# Altium schematic sheet JD-Signal-SCH-V2.0.SchDoc
size A2; SheetNumber: 1; SheetTotal: 1; SPICEModelCacheNNRSJVYG: <root> / <DocumentId>NNRSJVYG</DocumentId> / <CacheFrame Number="0"> / <Model Name="npn" Kind="MDL"> / <Text>*Default NPN BJT / *NPN Trans Pinout: C,B,E / .MODEL NPN NPN()</Text> / </Model> / <Model Name="xtal" Kind="CKT"> / <Text>*Generic type:crystal pkg:HC33/51 / .SUBCKT XTAL 1 2 PARAMS: FREQ=1Meg RS=750 C=13pf Q=1000 / LX 1 3 {((Q*RS)/(6.2831852*FREQ))} IC=0.5M / CX 3 4 {(1/(Q*6.2831852*FREQ*RS))} / C0 1 2 {C} / RS 4 2 {RS} / .ENDS XTAL</Text> / </Model> / </CacheFrame> / </root>
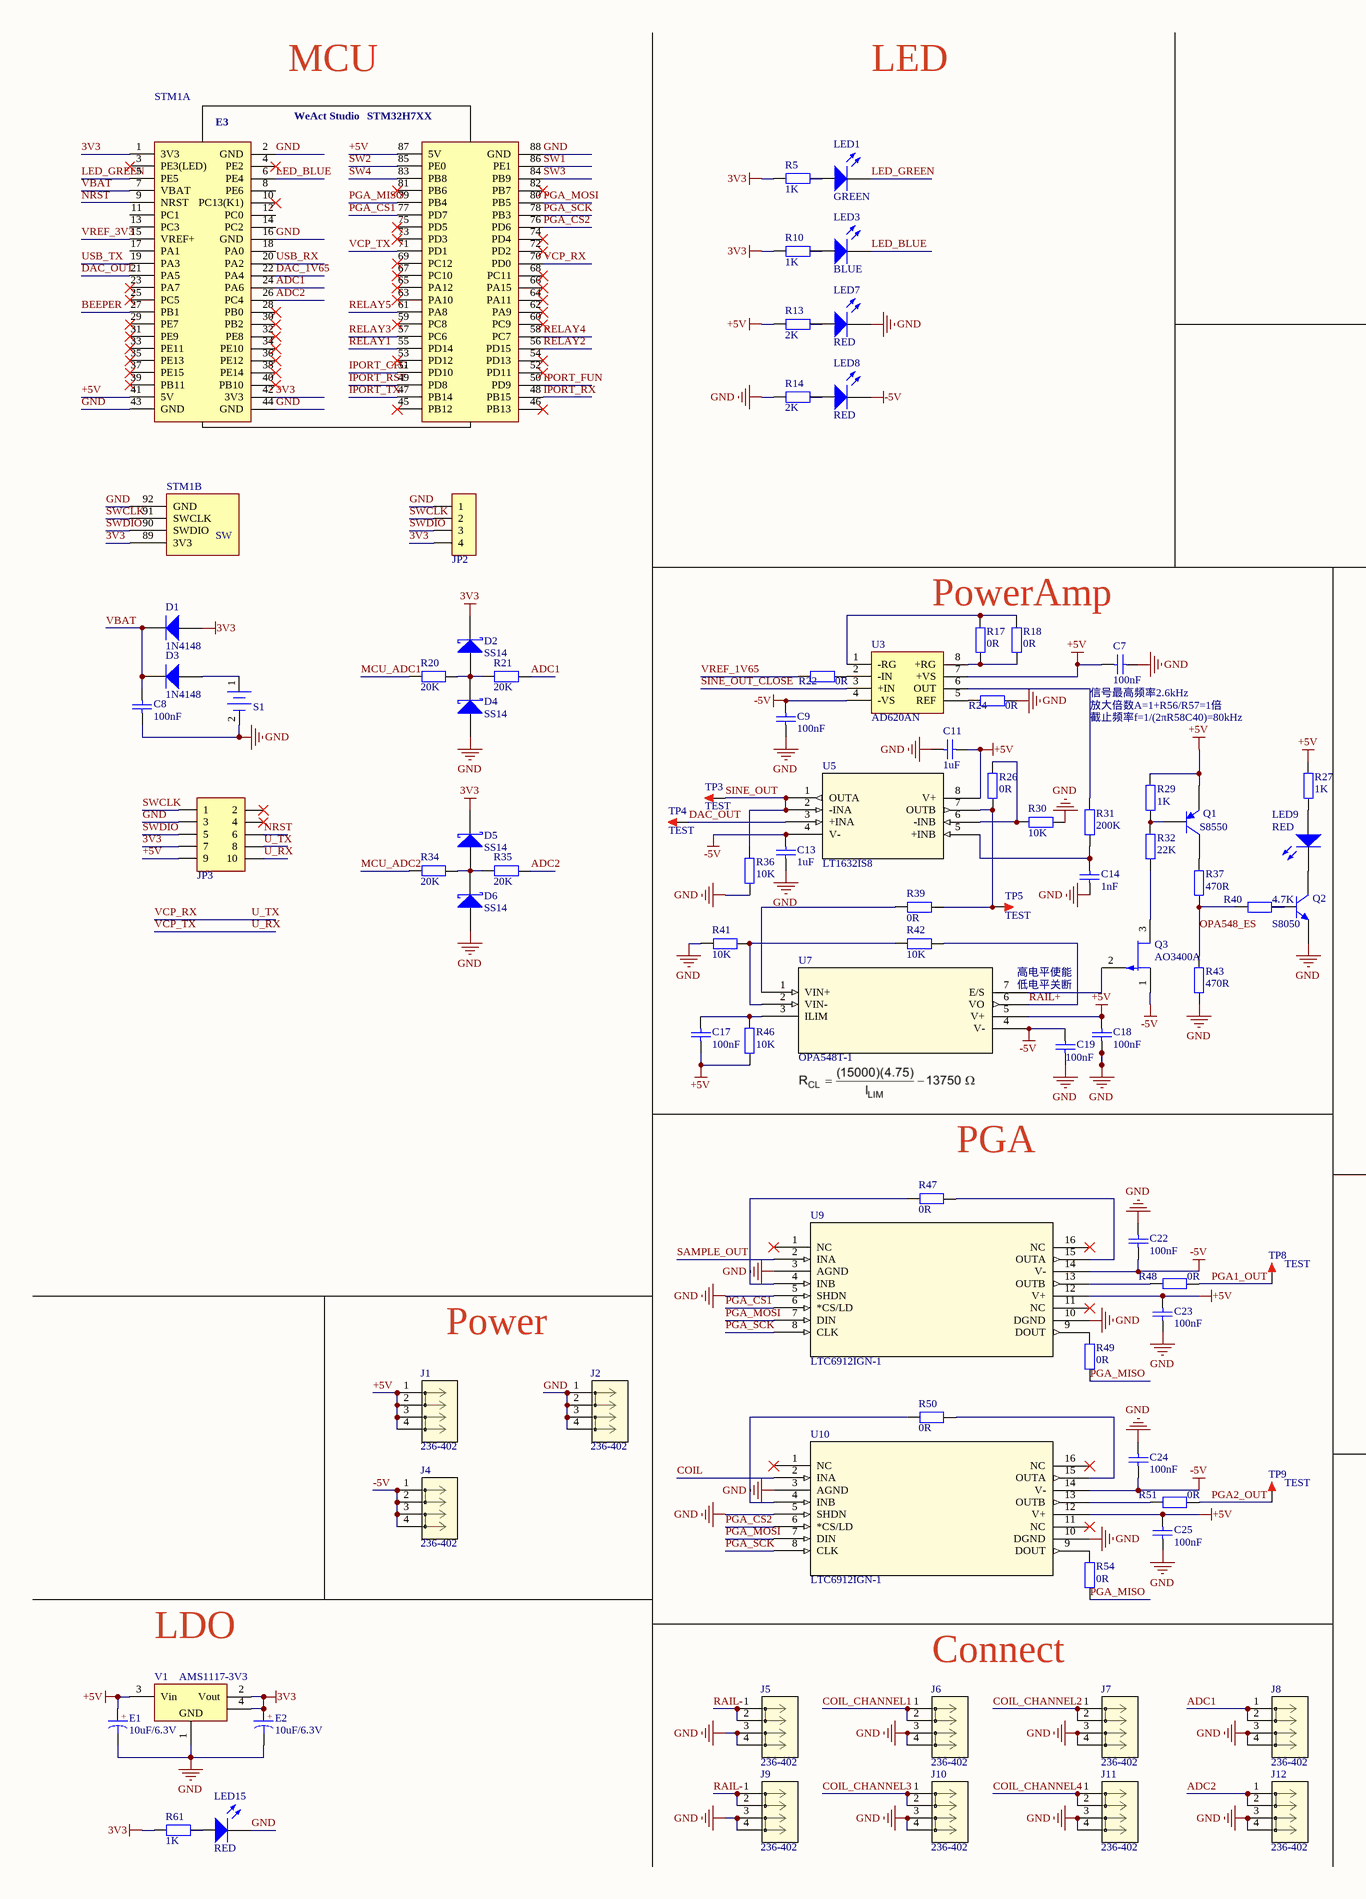
[diagram p0: JD-Signal-SCH-V2.0.SchDoc, left]
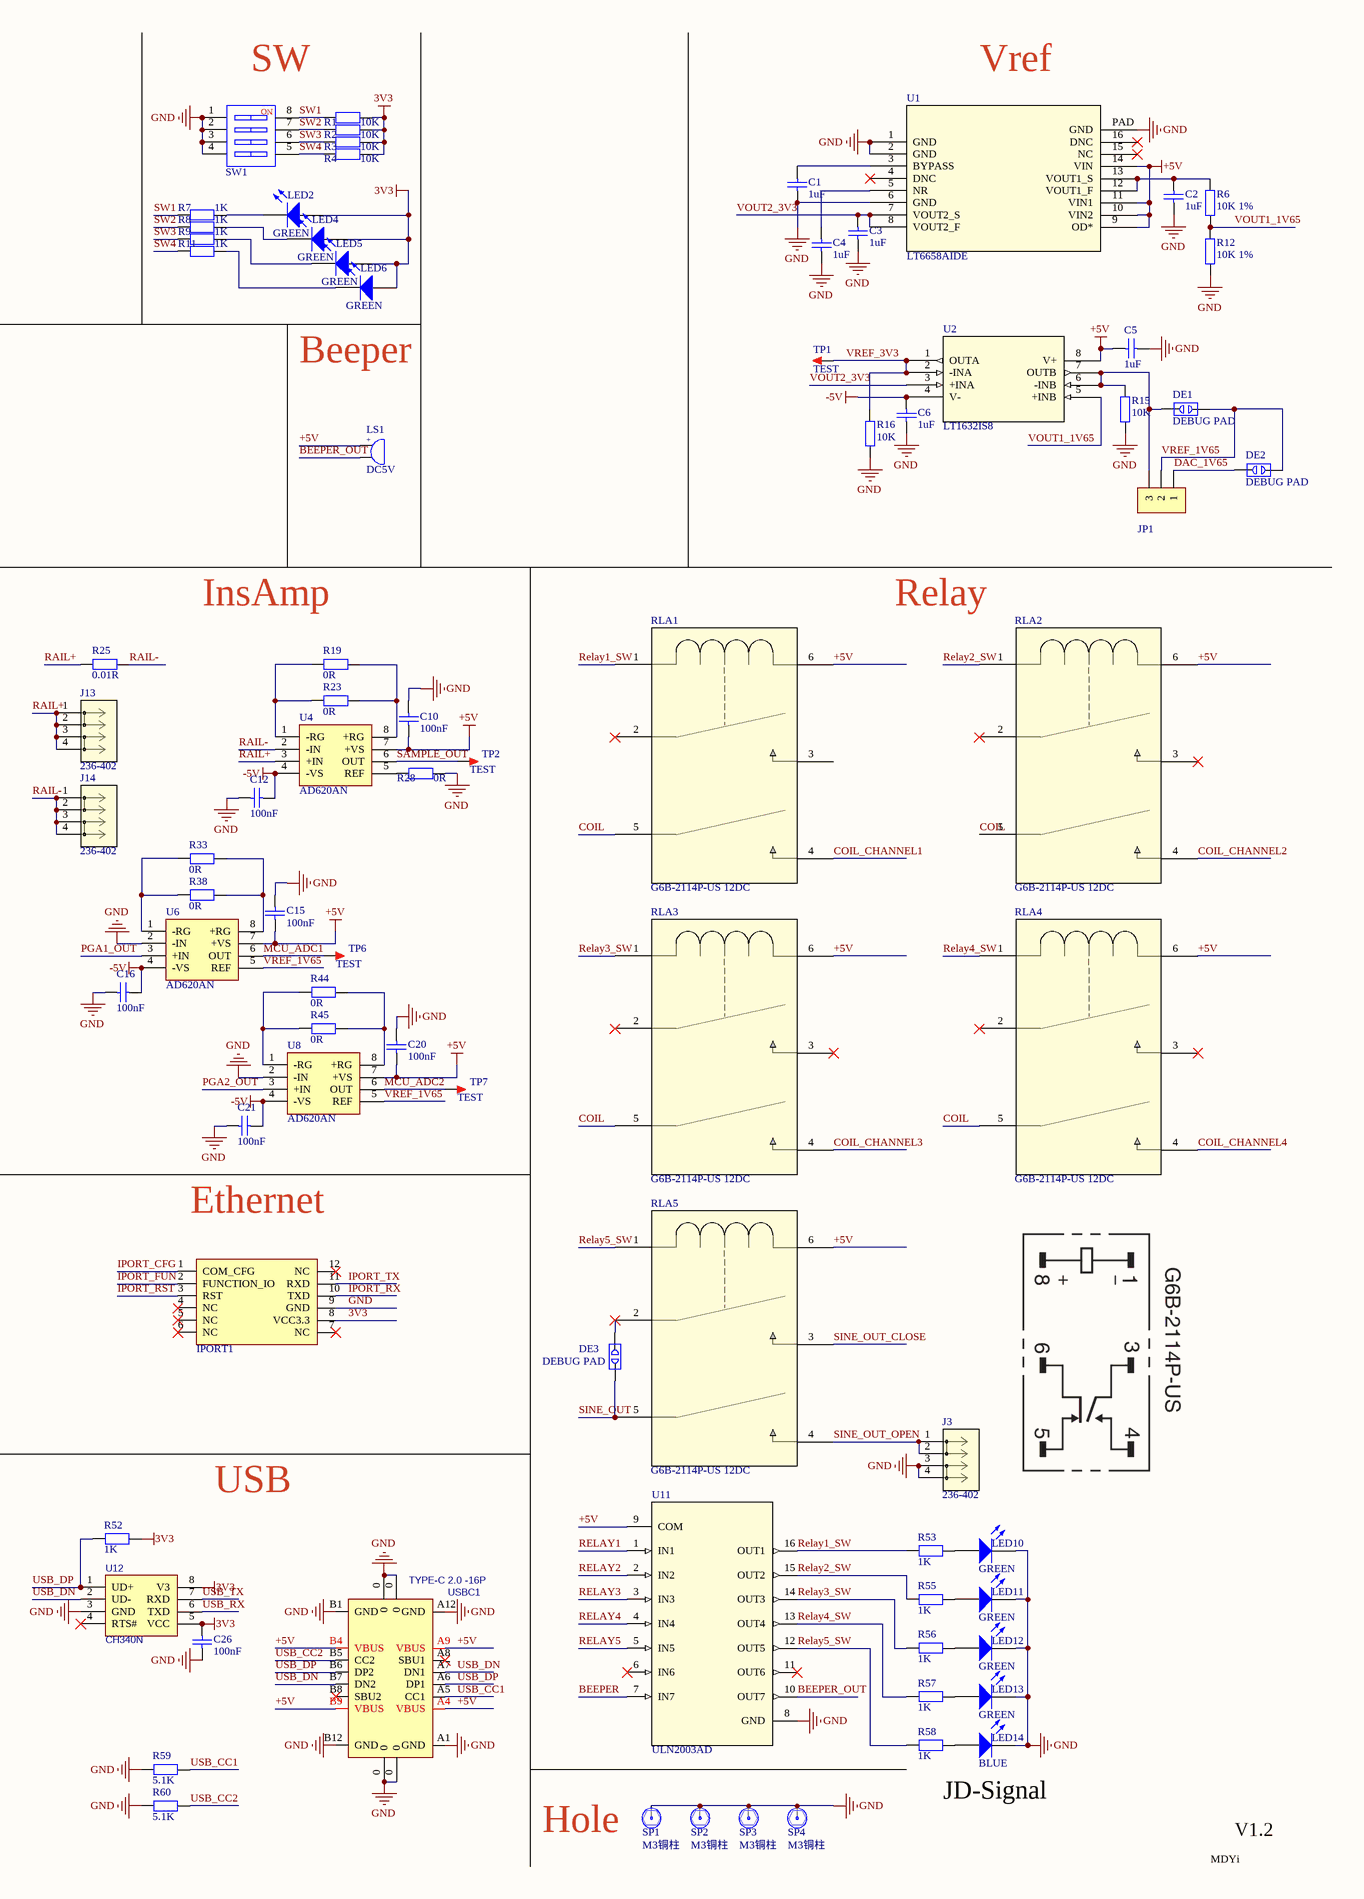
[diagram p1: JD-Signal-SCH-V2.0.SchDoc, right]

## Parts
C1  1uF  [C0603_M]
C2  1uF  [C0603_M]
C3  1uF  [C0603_M]
C4  1uF  [C0603_M]
C5  1uF  [C0603_M]
C6  1uF  [C0603_M]
C7  100nF  [C0603_M]
C8  100nF  [C0603_M]
C9  100nF  [C0603_M]
C10  100nF  [C0603_M]
C11  1uF  [C0603_M]
C12  100nF  [C0603_M]
C13  1uF  [C0603_M]
C14  1nF  [C0603_M]
C15  100nF  [C0603_M]
C16  100nF  [C0603_M]
C17  100nF  [C0603_M]
C18  100nF  [C0603_M]
C19  100nF  [C0603_M]
C20  100nF  [C0603_M]
C21  100nF  [C0603_M]
C22  100nF  [C0603_M]
C23  100nF  [C0603_M]
C24  100nF  [C0603_M]
C25  100nF  [C0603_M]
C26  100nF  [C0603_M]
D1  1N4148  [SOD-323]
D2  SS14  [SMA]
D3  1N4148  [SOD-323]
D4  SS14  [SMA]
D5  SS14  [SMA]
D6  SS14  [SMA]
DE1  DEBUG PAD  [DEBUG_B]
DE2  DEBUG PAD  [DEBUG_B]
DE3  DEBUG PAD  [DEBUG_B]
E1  10uF/6.3V  [C_3216]
E2  10uF/6.3V  [C_3216]
IPORT1  IPORT-3  [IPORT]  (value not drawn)
J1  236-402  [CONN_236-402_WAG]
J2  236-402  [CONN_236-402_WAG]
J3  236-402  [CONN_236-402_WAG]
J4  236-402  [CONN_236-402_WAG]
J5  236-402  [CONN_236-402_WAG]
J6  236-402  [CONN_236-402_WAG]
J7  236-402  [CONN_236-402_WAG]
J8  236-402  [CONN_236-402_WAG]
J9  236-402  [CONN_236-402_WAG]
J10  236-402  [CONN_236-402_WAG]
J11  236-402  [CONN_236-402_WAG]
J12  236-402  [CONN_236-402_WAG]
J13  236-402  [CONN_236-402_WAG]
J14  236-402  [CONN_236-402_WAG]
JP1  HDR-1X3  [HDR2.54-LI-3P]  (value not drawn)
JP2  HDR-1X4  [HDR2.54-LI-4P]  (value not drawn)
JP3  Header 5X2  [HDR2.54-LI-2x5P]  (value not drawn)
LED1  GREEN  [LED0603_R]
LED2  GREEN  [LED0603_R]
LED3  BLUE  [LED0603_R]
LED4  GREEN  [LED0603_R]
LED5  GREEN  [LED0603_R]
LED6  GREEN  [LED0603_R]
LED7  RED  [LED0603_R]
LED8  RED  [LED0603_R]
LED9  RED  [LED0603_R]
LED10  GREEN  [LED0603_R]
LED11  GREEN  [LED0603_R]
LED12  GREEN  [LED0603_R]
LED13  GREEN  [LED0603_R]
LED14  BLUE  [LED0603_R]
LED15  RED  [LED0603_R]
LS1  DC5V  [BEEP 5x9x5.5]
Q1  S8550  [SOT23]
Q2  S8050  [SOT23]
Q3  AO3400A  [SOT23]
R1  10K  [R0603_M]
R2  10K  [R0603_M]
R3  10K  [R0603_M]
R4  10K  [R0603_M]
R5  1K  [R0603_M]
R6  10K 1%  [R0603_M]
R7  1K  [R0603_M]
R8  1K  [R0603_M]
R9  1K  [R0603_M]
R10  1K  [R0603_M]
R11  1K  [R0603_M]
R12  10K 1%  [R0603_M]
R13  2K  [R0603_M]
R14  2K  [R0603_M]
R15  10K  [R0603_M]
R16  10K  [R0603_M]
R17  0R  [R0603_M]
R18  0R  [AXIAL0.4-1/4W]
R19  0R  [AXIAL0.4-1/4W]
R20  20K  [R0603_M]
R21  20K  [R0603_M]
R22  0R  [R0603_M]
R23  0R  [R0603_M]
R24  0R  [R0603_M]
R25  0.01R  [HS25]
R26  0R  [R0603_M]
R27  1K  [R0603_M]
R28  0R  [R0603_M]
R29  1K  [R0603_M]
R30  10K  [R0603_M]
R31  200K  [R0603_M]
R32  22K  [R0603_M]
R33  0R  [AXIAL0.4-1/4W]
R34  20K  [R0603_M]
R35  20K  [R0603_M]
R36  10K  [R0603_M]
R37  470R  [R0603_M]
R38  0R  [R0603_M]
R39  0R  [R0603_M]
R40  4.7K  [R0603_M]
R41  10K  [R0603_M]
R42  10K  [R0603_M]
R43  470R  [R0603_M]
R44  0R  [AXIAL0.4-1/4W]
R45  0R  [R0603_M]
R46  10K  [R1210_M]
R47  0R  [R0603_M]
R48  0R  [R0603_M]
R49  0R  [R0603_M]
R50  0R  [R0603_M]
R51  0R  [R0603_M]
R52  1K  [R0603_M]
R53  1K  [R0603_M]
R54  0R  [R0603_M]
R55  1K  [R0603_M]
R56  1K  [R0603_M]
R57  1K  [R0603_M]
R58  1K  [R0603_M]
R59  5.1K  [R0603_M]
R60  5.1K  [R0603_M]
R61  1K  [R0603_M]
RLA1  G6B-2114P-US 12DC  [RELAY_G6B-2114P_OMR]
RLA2  G6B-2114P-US 12DC  [RELAY_G6B-2114P_OMR]
RLA3  G6B-2114P-US 12DC  [RELAY_G6B-2114P_OMR]
RLA4  G6B-2114P-US 12DC  [RELAY_G6B-2114P_OMR]
RLA5  G6B-2114P-US 12DC  [RELAY_G6B-2114P_OMR]
S1  VBAT  [CR2032_A]  (value not drawn)
SP1  M3铜柱  [M3x4+6_N]
SP2  M3铜柱  [M3x4+6_N]
SP3  M3铜柱  [M3x4+6_N]
SP4  M3铜柱  [M3x4+6_N]
STM1  U1  [STM32H7xx Core Board]  (value not drawn)  (parts A,B of 2)
SW1  DIP-SW-4P  [SW DIP-4P]  (value not drawn)
TP1  TEST  [TEST 1.6]
TP2  TEST  [TEST 1.6]
TP3  TEST  [TEST 1.6]
TP4  TEST  [TEST 1.6]
TP5  TEST  [TEST 1.6]
TP6  TEST  [TEST 1.6]
TP7  TEST  [TEST 1.6]
TP8  TEST  [TEST 1.6]
TP9  TEST  [TEST 1.6]
U1  LT6658AIDE  [MSOP16]
U2  LT1632IS8  [SO-8]
U3  AD620AN  [SOIC-8]
U4  AD620AN  [SOIC-8]
U5  LT1632IS8  [SO-8]
U6  AD620AN  [SOIC-8]
U7  OPA548T-1  [TO-220-7 - 90*45]
U8  AD620AN  [SOIC-8]
U9  LTC6912IGN-1  [TSSOP16_M]
U10  LTC6912IGN-1  [TSSOP16_M]
U11  ULN2003AD  [SOP16]
U12  CH340N  [SOIC-8]
USBC1  TYPE-C 2.0 -16P  [USB-C-SMD_16P]
V1  AMS1117-3V3  [SOT223_M]

## Nets
3V3: C26.2 D1.1(A) D2.2(K) D5.2(K) E2.1(A) IPORT1.8(VCC3.3) JP2.4 JP3.7 LED2.1(A) LED4.1(A) LED5.1(A) LED6.1(A) R1.1 R2.1 R3.1 R4.1 R5.2 R10.2 R52.1 R61.2 STM1.1(3V3) STM1.42(3V3) STM1.89(3V3) U12.5(VCC) U12.8(V3) V1.2(Vout) V1.4(GND)
+5V: C5.1 C7.2 C10.1 C11.2 C15.1 C17.1 C18.1 C20.1 C23.2 C25.2 E1.1(A) J1.1 J1.2 J1.3 J1.4 JP3.9 LS1.1 Q1.1(E) R13.2 R27.1 R29.1 R46.1 RLA1.6 RLA2.6 RLA3.6 RLA4.6 RLA5.6 STM1.41(5V) STM1.87(5V) U1.9(OD*) U1.10(VIN2) U1.11(VIN1) U1.14(VIN) U2.8(V+) U3.7(+VS) U4.7(+VS) U5.8(V+) U6.7(+VS) U7.5(V+) U8.7(+VS) U9.12(V+) U10.12(V+) U11.9(COM) USBC1.A4(VBUS) USBC1.A9(VBUS) USBC1.B4(VBUS) USBC1.B9(VBUS) V1.3(Vin)
-5V: C6.2 C9.1 C12.1 C13.2 C16.1 C19.2 C21.1 C22.1 C24.1 J4.1 J4.2 J4.3 J4.4 LED8.2(K) Q3.1(D) U2.4(V-) U3.4(-VS) U4.4(-VS) U5.4(V-) U6.4(-VS) U7.4(V-) U8.4(-VS) U9.14(V-) U10.14(V-)
GND: C1.1 C2.1 C3.1 C4.1 C5.2 C6.1 C7.1 C8.1 C9.2 C10.2 C11.1 C12.2 C13.1 C14.1 C15.2 C16.2 C18.2 C19.1 C20.2 C21.2 C22.2 C23.1 C24.2 C25.1 C26.1 D4.1(A) D6.1(A) E1.2(K) E2.2(K) IPORT1.9(GND) J2.1 J2.2 J2.3 J2.4 J3.3 J3.4 J5.3 J5.4 J6.3 J6.4 J7.3 J7.4 J8.3 J8.4 J9.3 J9.4 J10.3 J10.4 J11.3 J11.4 J12.3 J12.4 JP2.1 JP3.3 LED7.2(K) LED10.2(K) LED11.2(K) LED12.2(K) LED13.2(K) LED14.2(K) LED15.2(K) Q2.1(E) R12.1 R14.2 R15.1 R16.1 R24.1 R28.1 R30.1 R36.1 R41.2 R43.2 R59.2 R60.2 S1.2 SP1.1 SP2.1 SP3.1 SP4.1 STM1.2(GND) STM1.16(GND) STM1.43(GND) STM1.44(GND) STM1.88(GND) STM1.92(GND) SW1.1 SW1.2 SW1.3 SW1.4 U1.1(GND) U1.2(GND) U1.6(GND) U1.PAD(GND) U6.2(-IN) U8.2(-IN) U9.3(AGND) U9.5(SHDN) U9.10(DGND) U10.3(AGND) U10.5(SHDN) U10.10(DGND) U11.8(GND) U12.3(GND) USBC1.0 USBC1.A1(GND) USBC1.A12(GND) USBC1.B1(GND) USBC1.B12(GND) V1.1(GND)
ADC1: J8.1 J8.2 R21.1 STM1.24(PA6)
ADC2: J12.1 J12.2 R35.1 STM1.26(PC4)
BEEPER: STM1.27(PB1) U11.7(IN7)
BEEPER_OUT: LS1.2 U11.10(OUT7)
COIL: RLA1.5 RLA2.5 RLA3.5 RLA4.5 U10.2(INA)
COIL_CHANNEL1: J6.1 J6.2 RLA1.4
COIL_CHANNEL2: J7.1 J7.2 RLA2.4
COIL_CHANNEL3: J10.1 J10.2 RLA3.4
COIL_CHANNEL4: J11.1 J11.2 RLA4.4
DAC_1V65: DE2.1 JP1.1 STM1.22(PA4)
DAC_OUT: STM1.21(PA5) TP4.1 U5.3(+INA)
IPORT_CFG: IPORT1.1(COM_CFG) STM1.51(PD10)
IPORT_FUN: IPORT1.2(FUNCTION_IO) STM1.50(PD9)
IPORT_RST: IPORT1.3(RST) STM1.49(PD8)
IPORT_RX: IPORT1.10(TXD) STM1.48(PB15)
IPORT_TX: IPORT1.11(RXD) STM1.47(PB14)
LED_BLUE: LED3.2(K) STM1.6(PE4)
LED_GREEN: LED1.2(K) STM1.5(PE5)
MCU_ADC1: R20.2 TP6.1 U6.6(OUT)
MCU_ADC2: R34.2 TP7.1 U8.6(OUT)
NRST: JP3.6 STM1.9(NRST)
OPA548_ES: R37.2 R40.2 R43.1
PGA1_OUT: R48.2 TP8.1 U6.3(+IN)
PGA2_OUT: R51.2 TP9.1 U8.3(+IN)
PGA_CS1: STM1.77(PD7) U9.6(*CS/LD)
PGA_CS2: STM1.76(PD6) U10.6(*CS/LD)
PGA_MISO: R49.1 R54.1 STM1.79(PB4)
PGA_MOSI: STM1.80(PB5) U9.7(DIN) U10.7(DIN)
PGA_SCK: STM1.78(PB3) U9.8(CLK) U10.8(CLK)
RAIL+: J13.1 J13.2 J13.3 J13.4 R25.1 R42.1 U4.3(+IN) U7.6(VO)
RAIL-: J5.1 J5.2 J9.1 J9.2 J14.1 J14.2 J14.3 J14.4 R25.2 U4.2(-IN)
RELAY1: STM1.55(PD14) U11.1(IN1)
Relay1_SW: R53.1 RLA1.1 U11.16(OUT1)
RELAY2: STM1.56(PD15) U11.2(IN2)
Relay2_SW: R55.1 RLA2.1 U11.15(OUT2)
RELAY3: STM1.57(PC6) U11.3(IN3)
Relay3_SW: R56.1 RLA3.1 U11.14(OUT3)
RELAY4: STM1.58(PC7) U11.4(IN4)
Relay4_SW: R57.1 RLA4.1 U11.13(OUT4)
RELAY5: STM1.61(PA8) U11.5(IN5)
Relay5_SW: R58.1 RLA5.1 U11.12(OUT5)
SAMPLE_OUT: TP2.1 U4.6(OUT) U9.2(INA)
SINE_OUT: DE3.1 R36.2 RLA5.5 TP3.1 U5.1(OUTA) U5.2(-INA)
SINE_OUT_CLOSE: RLA5.3 U3.3(+IN)
SINE_OUT_OPEN: J3.1 J3.2 RLA5.4
SW1: R1.2 R7.2 STM1.86(PE1) SW1.8
SW2: R2.2 R8.2 STM1.85(PE0) SW1.7
SW3: R3.2 R9.2 STM1.84(PB9) SW1.6
SW4: R4.2 R11.2 STM1.83(PB8) SW1.5
SWCLK: JP2.2 JP3.1 STM1.91(SWCLK)
SWDIO: JP2.3 JP3.5 STM1.90(SWDIO)
U_RX: JP3.10 STM1.71(PD1)  [also labelled VCP_TX]
U_TX: JP3.8 STM1.70(PD0)  [also labelled VCP_RX]
USB_CC1: R59.1 USBC1.A5(CC1)
USB_CC2: R60.1 USBC1.B5(CC2)
USB_DN: U12.2(UD-) USBC1.A7(DN1) USBC1.B7(DN2)
USB_DP: R52.2 U12.1(UD+) USBC1.A6(DP1) USBC1.B6(DP2)
USB_RX: STM1.20(PA2) U12.6(TXD)
USB_TX: STM1.19(PA3) U12.7(RXD)
VBAT: C8.2 D1.2(K) D3.2(K) STM1.7(VBAT)
VOUT1_1V65: R6.1 R12.2 U2.5(+INB)
VOUT2_3V3: C3.2 U1.7(VOUT2_S) U1.8(VOUT2_F) U2.3(+INA)
VREF_1V65: DE1.2 DE2.2 JP1.2 R22.2 U6.5(REF) U8.5(REF)
VREF_3V3: R16.2 STM1.15(VREF+) TP1.1 U2.1(OUTA) U2.2(-INA)
NetC1_2: C1.2 U1.3(BYPASS)
NetC2_2: C2.2 R6.2 U1.12(VOUT1_F) U1.13(VOUT1_S)
NetC4_2: C4.2 U1.5(NR)
NetC14_2: C14.2 R31.2 U5.5(+INB)
NetC17_2: C17.2 R46.2 U7.3(ILIM)
NetD2_1: D2.1(A) D4.2(K) R20.1 R21.2
NetD3_1: D3.1(A) S1.1
NetD5_1: D5.1(A) D6.2(K) R34.1 R35.2
NetDE1_1: DE1.1 JP1.3 R15.2 U2.6(-INB) U2.7(OUTB)
NetDE3_2: DE3.2 RLA5.2
NetLED1_1: LED1.1(A) R5.1
NetLED2_2: LED2.2(K) R7.1
NetLED3_1: LED3.1(A) R10.1
NetLED4_2: LED4.2(K) R8.1
NetLED5_2: LED5.2(K) R9.1
NetLED6_2: LED6.2(K) R11.1
NetLED7_1: LED7.1(A) R13.1
NetLED8_1: LED8.1(A) R14.1
NetLED9_1: LED9.1(A) R27.2
NetLED9_2: LED9.2(K) Q2.3(C)
NetLED10_1: LED10.1(A) R53.2
NetLED11_1: LED11.1(A) R55.2
NetLED12_1: LED12.1(A) R56.2
NetLED13_1: LED13.1(A) R57.2
NetLED14_1: LED14.1(A) R58.2
NetLED15_1: LED15.1(A) R61.1
NetQ1_2: Q1.2(B) R29.2 R32.1
NetQ1_3: Q1.3(C) R37.1
NetQ2_2: Q2.2(B) R40.1
NetQ3_2: Q3.2(G) U7.7(E/S)
NetQ3_3: Q3.3(S) R32.2
NetR17_1: R17.1 R18.1 U3.1(-RG)
NetR17_2: R17.2 R18.2 U3.8(+RG)
NetR19_1: R19.1 R23.1 U4.8(+RG)
NetR19_2: R19.2 R23.2 U4.1(-RG)
NetR22_1: R22.1 U3.2(-IN)
NetR24_2: R24.2 U3.5(REF)
NetR26_1: R26.1 R30.2 U5.6(-INB)
NetR26_2: R26.2 R39.2 TP5.1 U5.7(OUTB)
NetR28_2: R28.2 U4.5(REF)
NetR31_1: R31.1 U3.6(OUT)
NetR33_1: R33.1 R38.1 U6.8(+RG)
NetR33_2: R33.2 R38.2 U6.1(-RG)
NetR39_1: R39.1 U7.1(VIN+)
NetR41_1: R41.1 R42.2 U7.2(VIN-)
NetR44_1: R44.1 R45.1 U8.8(+RG)
NetR44_2: R44.2 R45.2 U8.1(-RG)
NetR47_1: R47.1 U9.15(OUTA)
NetR47_2: R47.2 U9.4(INB)
NetR48_1: R48.1 U9.13(OUTB)
NetR49_2: R49.2 U9.9(DOUT)
NetR50_1: R50.1 U10.15(OUTA)
NetR50_2: R50.2 U10.4(INB)
NetR51_1: R51.1 U10.13(OUTB)
NetR54_2: R54.2 U10.9(DOUT)

Not connected (* = marked no-connect by the designer): IPORT1 4(NC)* 5(NC)* 6(NC)* 7(NC)* 12(NC)*; JP3 2* 4*; RLA1 2(3)* 3(4); RLA2 2(3)* 3(4)*; RLA3 2(3)* 3(4)*; RLA4 2(3)* 3(4)*; STM1 3(PE3(LED))* 4(PE2)* 8(PE6) 10(PC13(K1))* 11(PC1) 12(PC0) 13(PC3) 14(PC2) 17(PA1) 18(PA0) 23(PA7)* 25(PC5)* 28(PB0)* 29(PE7)* 30(PB2)* 31(PE9)* 32(PE8)* 33(PE11)* 34(PE10)* 35(PE13)* 36(PE12)* 37(PE15)* 38(PE14)* 39(PB11)* 40(PB10)* 45(PB12)* 46(PB13)* 52(PD11)* 53(PD12)* 54(PD13)* 59(PC8)* 60(PC9)* 62(PA9)* 63(PA10)* 64(PA11)* 65(PA12)* 66(PA15)* 67(PC10)* 68(PC11)* 69(PC12)* 72(PD2)* 73(PD3)* 74(PD4)* 75(PD5)* 81(PB6)* 82(PB7)*; U1 4(DNC)* 15(NC)* 16(DNC)*; U9 1(NC)* 11(NC)* 16(NC)*; U10 1(NC)* 11(NC)* 16(NC)*; U11 6(IN6)* 11(OUT6)*; U12 4(RTS#)*; USBC1 A8(SBU1)* B8(SBU2)*

## Notes on the sheet
- MCU
- LED
- (near SW1) SW
- Vref
- Beeper
- PowerAmp
- InsAmp
- Relay
- (near C7) 信号最高频率2.6kHz
- (near C7) 放大倍数A=1+R56/R57=1倍
- 截止频率f=1/(2πR58C40)=80kHz
- (near U7) 高电平使能
- (near U7) 低电平关断
- (near R47) PGA
- Ethernet
- Power
- USB
- LDO
- Connect
- JD-Signal
- (near SP1) Hole
- MDYi
- V1.2
- (in symbol BEEP) +
- (in symbol CT) +
- (in symbol DIP-SW-4P) NO
- (in symbol STM32H7xx WeActStudio CoreBoard, part A) WeAct Studio; STM32H7XX; E3
- (in symbol STM32H7xx WeActStudio CoreBoard, part B) SW

## Library data of the parts
C1-C26 = C: 贴片电容/MLCC电容; BOM名称: 无极性贴片电容; 联系下单店铺卖家 免费帮你查找封装: 联系下单店铺卖家 免费技术支持
D1 D3 = Diode 1N4148: High Conductance Fast Diode; Published: 8-Jun-2000; LatestRevisionDate: 17-Jul-2002; LatestRevisionNote: Re-released for DXP Platform.; DatasheetVersion: 1997; PackageReference: DO-35; Publisher: Altium Limited; PackageDescription: Diode, Axial; Body 3.8 x 1.9 mm (LxDia. max), Lead Dia. 0.53 mm (max); Code_JEDEC: DO-204-AH; ComponentLink1Description: Manufacturer Link; ComponentLink1URL: http://www.fairchildsemi.com/; ComponentLink2Description: Datasheet; ComponentLink2URL: http://www.fairchildsemi.com/ds/1N%2F1N4148.pdf
D2 D4-D6 = SS14: 肖特基二极管; 属性: 40V/1A; 当前库版本V2022.12.25 @淘宝卖家:黄晶宝石: 最新版本发布https://shop463601444.taobao.com; BOM名称: 肖特基二极管
DE1-DE3 = DEBUG: 调试断点焊盘; 联系下单店铺卖家 免费技术支持: 联系下单店铺卖家 免费帮你查找封装; BOM名称: 调试断点焊盘
E1 E2 = CT: 贴片钽电容; 联系下单店铺卖家 免费帮你查找封装: 联系下单店铺卖家 免费技术支持; BOM名称: 贴片钽电容
IPORT1 = IPORT-3: BOM名称: 12P连接器; 封装库来自淘宝卖家 ID：黄晶宝石: 其他店铺购入均为盗版假冒封装库; 联系卖家 免费查找封装: 唯一出售店铺网址https://shop463601444.taobao.com
J1-J14 = 236-402: No Description Available; Mfr_Name: Wago; Copyright: Copyright (C) 2022 Ultra Librarian. All rights reserved.; Manufacturer_Part_Number: 236-402; RefDes: RefDes; Type: DEV
JP1 = Header 3: 3P接插件; 联系卖家，免费查找封装: 唯一出售店铺网址https://shop463601444.taobao.com; 封装库来自淘宝卖家ID：黄晶宝石: 其他店铺购入均为盗版封装库，请立即申请退款，本店现金奖励50~200元; BOM名称: 3P接插件
JP2 = Header 4: 4P接插件; 联系卖家，免费查找封装: 唯一出售店铺网址https://shop463601444.taobao.com; 封装库来自淘宝卖家ID：黄晶宝石: 其他店铺购入均为盗版封装库，请立即申请退款，本店现金奖励50~200元; BOM名称: 4P接插件
JP3 = Header 5X2: 5*2P接插件; 联系卖家，免费查找封装: 唯一出售店铺网址https://shop463601444.taobao.com; 封装库来自淘宝卖家ID：黄晶宝石: 其他店铺购入均为盗版封装库，请立即申请退款，本店现金奖励50~200元; BOM名称: 5*2P接插件
LED1-LED15 = LED: 贴片LED; 封装库来自淘宝卖家：黄晶宝石: 其他店铺购入均为盗版封装库，无更新权益，退款现金奖励200~1000元; BOM名称: 贴片LED
LS1 = BEEP: 蜂鸣器; 联系下单店铺卖家 免费技术支持: 联系下单店铺卖家 免费帮你查找封装; BOM名称: 蜂鸣器
Q1 = 2N3906: PNP General Purpose Amplifier; Published: 8-Jun-2000; LatestRevisionDate: 15-Jan-2003; LatestRevisionNote: PCB Footprint 'BCY-W3/D4.7' replaced; DatasheetVersion: 1997; PackageVersion: Sep-1998; PackageReference: TO-92A; Publisher: Altium Limited; PackageDescription: TO, Flat Index; 3 In-Line, Axial Leads; Body Dia. 4.5mm; Leads 0.51 x 0.48 mm (max); ComponentLink1Description: Manufacturer Link; ComponentLink1URL: http://www.fairchildsemi.com/; ComponentLink2Description: Datasheet; ComponentLink2URL: http://www.fairchildsemi.com/ds/2N%2F2N3906.pdf
Q2 = 2N3904: NPN General Purpose Amplifier; Published: 8-Jun-2000; LatestRevisionDate: 15-Jan-2003; LatestRevisionNote: PCB Footprint 'BCY-W3/D4.7' replaced; DatasheetVersion: 1997; PackageVersion: Sep-1998; PackageReference: TO-92A; Publisher: Altium Limited; PackageDescription: TO, Flat Index; 3 In-Line, Axial Leads; Body Dia. 4.5mm; Leads 0.51 x 0.48 mm (max); ComponentLink1Description: Manufacturer Link; ComponentLink1URL: http://www.fairchildsemi.com/; ComponentLink2Description: Datasheet; ComponentLink2URL: http://www.fairchildsemi.com/ds/2N%2F2N3904.pdf
Q3 = JFET-P: P-Channel JFET; Published: 8-Jun-2000; LatestRevisionDate: 17-Jul-2002; LatestRevisionNote: Re-released for DXP Platform.; PackageReference: TO-18A; Publisher: Altium Limited; PackageDescription: SC-89; 3 Flat Leads; Body 1.6 x 1.6 x 0.7 mm, inc leads (LxWxH typ)
R1-R61 = R: 贴片电阻; 当前库版本V2022.10.7 @黄晶宝石: 最新版本发布https://shop463601444.taobao.com; BOM名称: 贴片电阻
RLA1-RLA5 = G6B-2114P-US 12DC: No Description Available; Mfr_Name: Omron; Copyright: Copyright (C) 2022 Ultra Librarian. All rights reserved.; Manufacturer_Part_Number: G6B-2114P-US 12DC; RefDes: RefDes; Type: DEV
S1 = VBAT: 纽扣电池
SP1-SP4 = 铜柱加头大焊盘: 铜柱; 联系下单店铺卖家 免费技术支持: 联系下单店铺卖家 免费帮你查找封装; BOM名称: 铜柱
STM1 = STM32H7xx WeActStudio CoreBoard
SW1 = DIP-SW-4P: 4路编码开关; 联系下单店铺卖家 免费技术支持: 联系下单店铺卖家 免费帮你查找封装; BOM名称: 4路编码开关
TP1-TP9 = TEST: 测试点; 联系下单店铺卖家 免费技术支持: 联系下单店铺卖家 免费帮你查找封装; BOM名称: 测试点
U1 = LT6658AIDE: No Description Available; Copyright: Copyright (C) 2021 Accelerated Designs. All rights reserved; RefDes: RefDes; Type: DEV
U2 U5 = LT1632IS8: No Description Available; Vendor: Linear Technology; Manufacturer_Part_Number: lt1632is8; Copyright: Copyright (C) 2021 Accelerated Designs. All rights reserved; RefDes: RefDes; Type: DEV
U3 U4 U6 U8 = AD620AN: CI-AD620AN; 封装库来自淘宝卖家：黄晶宝石: 获取最新版本库文件https://shop463601444.taobao.com
U7 = OPA548T-1: No Description Available; Mfr_Name: Texas Instruments; Copyright: Copyright (C) 2022 Ultra Librarian. All rights reserved.; Manufacturer_Part_Number: OPA548T-1; RefDes: RefDes; Type: DEV
U9 U10 = LTC6912IGN-1: No Description Available; Vendor: Linear Technology; Manufacturer_Part_Number: ltc6912ign-1; Copyright: Copyright (C) 2021 Accelerated Designs. All rights reserved; RefDes: RefDes; Type: DEV
U11 = ULN2003AD: No Description Available; Mfr_Name: Texas Instruments; Type: DEV; RefDes: RefDes; Copyright: Copyright (C) 2022 Ultra Librarian. All rights reserved.; Manufacturer_Part_Number: ULN2003AD
U12 = CH340N: USB转串口芯片, 内置晶振; 芯片厂商: WCH(南京沁恒); 当前库版本V2022.10.7 @淘宝卖家:黄晶宝石: 最新版本发布https://shop463601444.taobao.com
USBC1 = USB2.0_Type-C_16Pin: USB2.0_Type-C_16Pin母座; 当前库版本V2022.10.7 @淘宝卖家:黄晶宝石: 最新版本发布https://shop463601444.taobao.com
V1 = AMS1117: 三端稳压芯片; BOM名称: 稳压芯片; 当前库版本V2022.12.25 @淘宝卖家:黄晶宝石: 最新版本发布https://shop463601444.taobao.com